# EAGLE design USB_Switch_Tester (EAGLE 9.6.2)
AUTHOR: ladyada
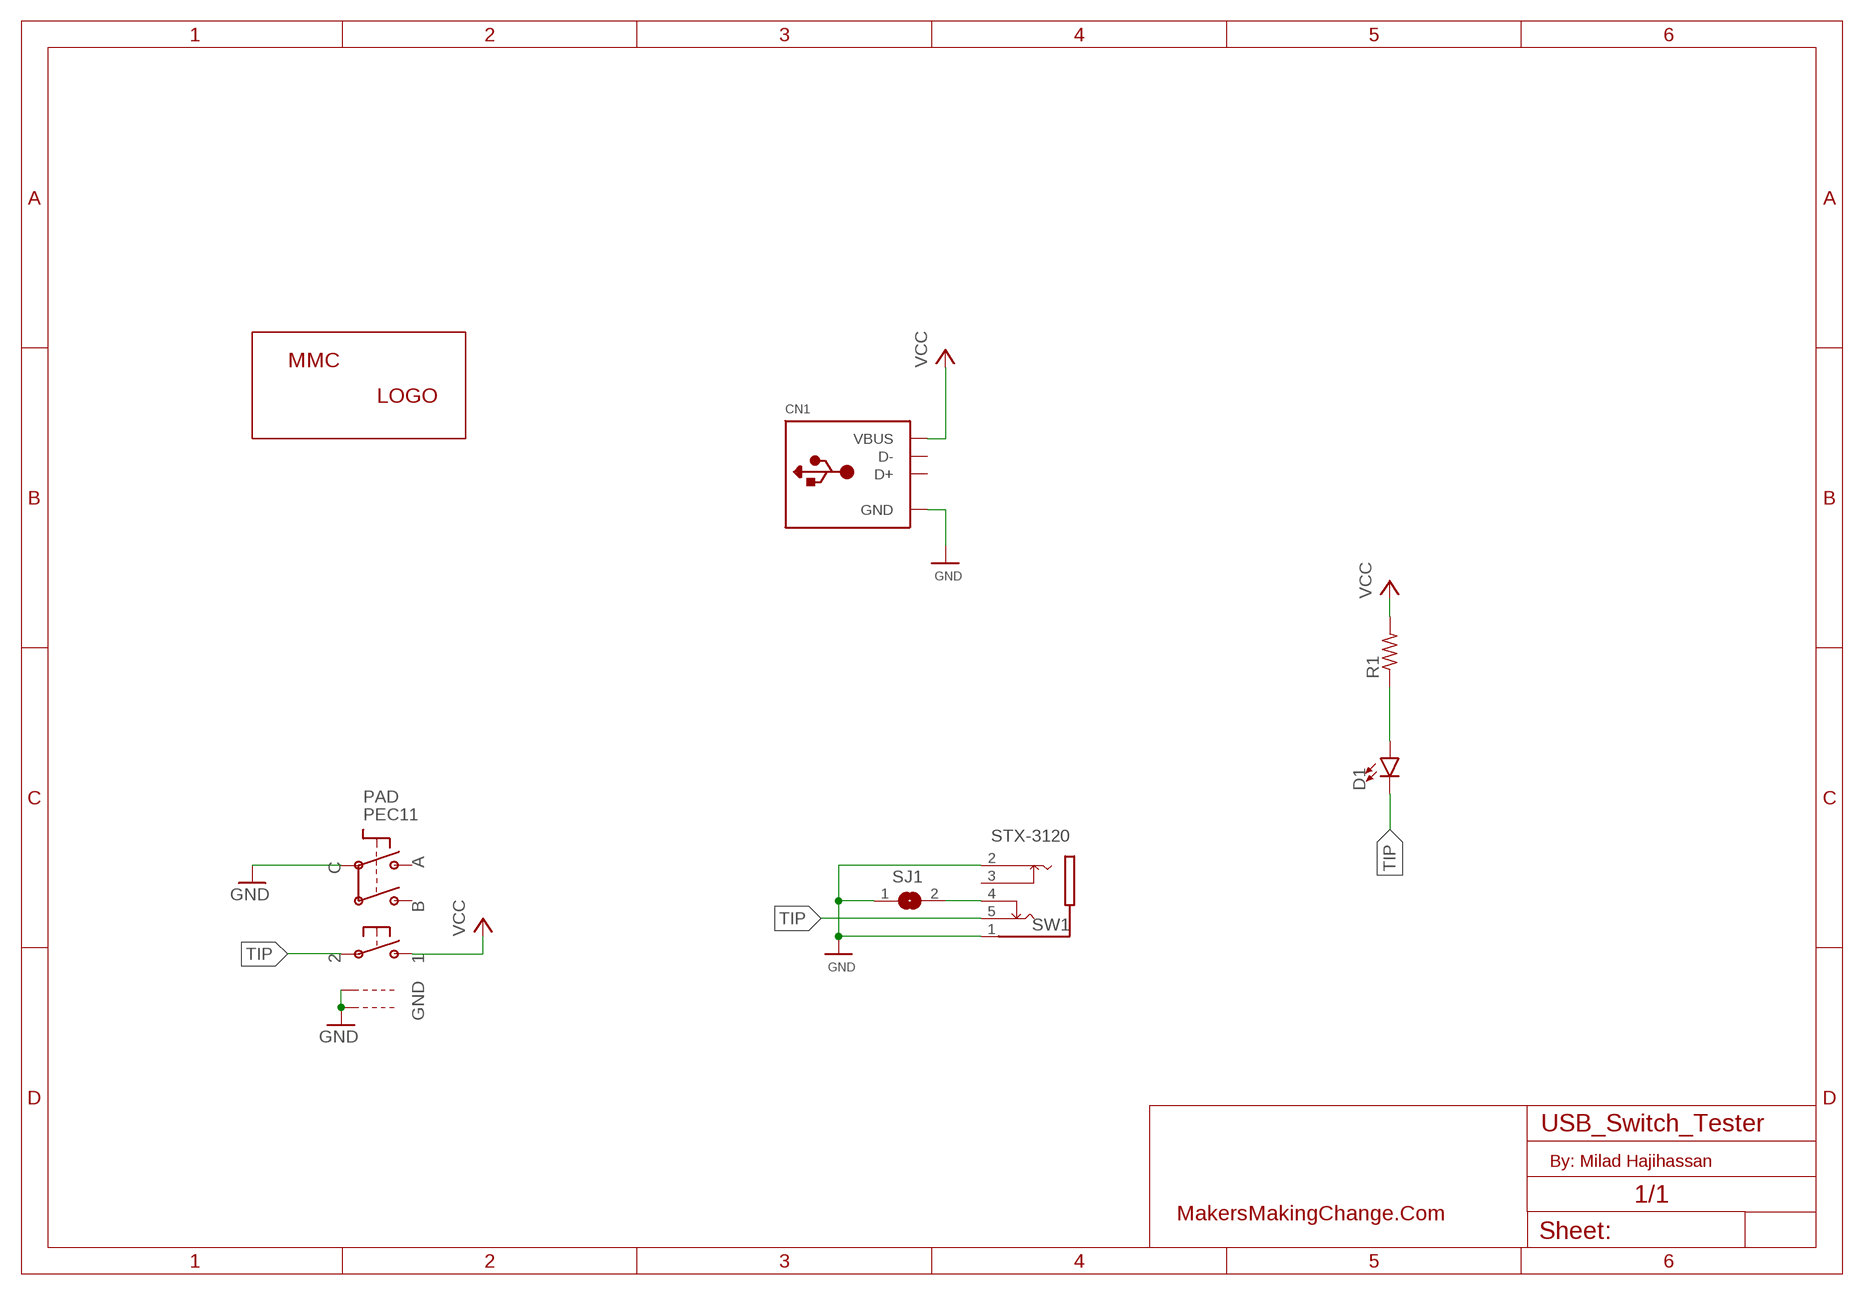
[diagram p0: schematic, sheet 1]

## Parts
CN1  MICROBUILDER_USB_TYPEAPCB  [MICROBUILDER_USBA_PCB]
D1  LED_5MM-5MM-RED  [LED_5MM_RED]
LABEL_LOGO  MMC_LOGO-XSM  [MMC_X-SMALL_LOGO]
PAD  PEC11  ADAFRUIT_ELECTROMECH_ENCODER_PLUS_SWITCH_BOURNS_PEC11  [ADAFRUIT_ELECTROMECH_PEC11+SWITCH]
R1  RESISTOR-US-0204/5  [RESISTOR_0204/5]
SJ1  SOLDERJUMPERREFLOW  [SOLDERJUMPER_REFLOW]
SW1  STX-3120  STX-3120-5B  [STX-3120-5B]

## Nets
GND: CN1.GND PAD.P$C PAD.P$GND1 PAD.P$GND2 SJ1.1 SW1.1 SW1.2
N$1: D1.A R1.1
N$2: SJ1.2 SW1.4
TIP: D1.K(C) PAD.P$2 SW1.5
VCC: CN1.VCC(VBUS) PAD.P$1 R1.2
Unconnected: CN1.USB_NEG(D-) CN1.USB_PLUS(D+) PAD.P$A PAD.P$B SW1.3

## Notes on the sheet
- By: Milad Hajihassan
- MakersMakingChange.Com

## Library data of the parts
CN1 = USB_Switch_Tester:MICROBUILDER_USB_TYPEA: USB - Type A Connectors Male types stick out and are inserted into a PC or matching females parts (these are the connectors used on USB Memory Sticks, etc.). Female parts are generally used for USB Host and accept a male-type connector. SMT - 4UCON: 10017 PTHFML - Digikey: 609-1045-ND, 4UCon: 05241 PCB - Use 2.0mm thick PCBs with this footprint
D1 = MMC Eagle:LED_5MM-: LED (Generic) Standard schematic elements and footprints for 5mm, 3mm, 1206, and 0603 sized LEDs. Generic LEDs with no color specified.
LABEL_LOGO = MMC Eagle:MMC_LOGO-
PAD = USB_Switch_Tester:ADAFRUIT_ELECTROMECH_ENCODER_PLUS_SWITCH: Rotary Encoder with Built-In Switch PEC11 - 24 Step, PEC11-4215F-S24 - http://www.adafruit.com/products/377
R1 = MMC Eagle:RESISTOR-US-: RESISTOR, American symbol
SJ1 = MMC_SMD:SOLDERJUMPER: SMD Solder JUMPER Solder the two pads together to create a connection, or remove the solder to break it. REFLOW - Use this footprint for solder paste and reflow ovens. WAVE - Use this footprint for hand-soldering (larger pads). CLOSED - Has a trace between the two pads to ensure it is closed by default. The trace needs to be cut to disable the jumper, and can be closed again by creating a solder bridge between the two pads.
SW1 = MMC Eagle:STX-3120-5B

## Board
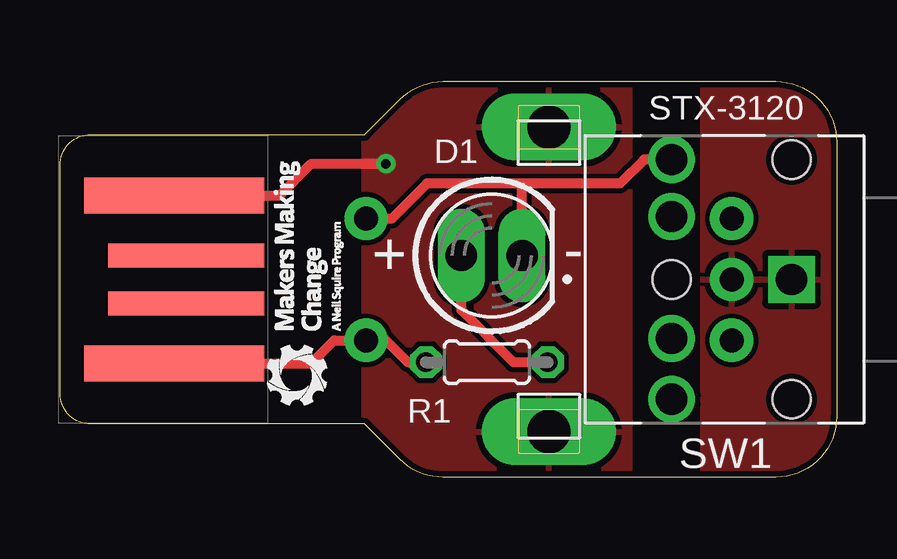
[diagram p1: board, top side]
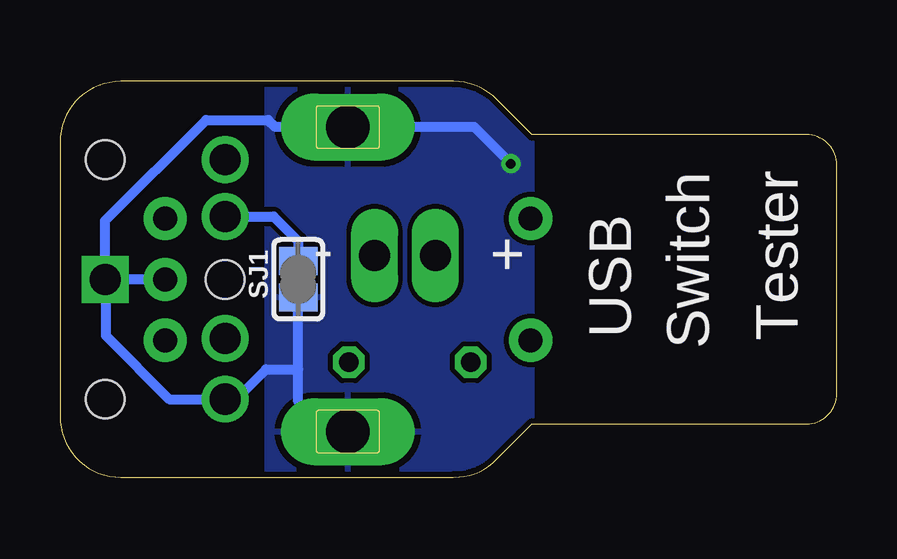
[diagram p2: board, bottom side, seen from below]

Size 32.38 x 16.51 mm. Coordinates in mm from the lower left corner, seen from the top.
Outline: 0,13.02 arc-90 1.27,14.29 12.7,14.29 14.18,15.77 arc-45 15.97,16.51 29.84,16.51 arc-90 32.38,13.97 32.38,2.54 arc-90 29.84,0 15.97,0 arc-45 14.18,0.74 12.7,2.22 1.27,2.22 arc-90 0,3.49 0,13.02
Copper layers (1*16): Top 0.035mm / dielectric 1.5mm / Bottom 0.035mm
Design rules "adafruit 8-8 *": minimum track width 8mil, minimum drill 15.5mil, track to track 8mil, track to pad 8mil, pad to pad 8mil, via to via 8mil, smd to smd 8mil, copper to edge 10mil, drill to drill 8mil, minimum pad ring 10mil, minimum via ring 8mil, stop-mask expansion 2mil, vias tented up to drill 20mil, thermal gap 10mil

### Footprints (pad centres in the part's own frame; a part is rotated, then mirrored left to right if it is on the bottom)
MICROBUILDER_USBA_PCB = smd 7.5 x 1.5: GND -0.2,3.5; VCC -0.2,-3.5 | smd 6.5 x 1: USB_NEG 0.3,-1; USB_PLUS 0.3,1
LED_5MM_RED = drill 1.3 pad 1.676 long: A -1.27,0; K 1.27,0
ADAFRUIT_ELECTROMECH_PEC11+SWITCH = drill 1 pad 1.8: P$1 -2.54,7.62; P$2 2.54,7.62; P$A -2.54,-7.62; P$B 2.54,-7.62; P$C 0,-7.62 | drill 1.8 pad 2.8 long: P$GND1 -6.35,0; P$GND2 6.35,0
RESISTOR_0204/5 = drill 0.813 octagon: 1 -2.54,0; 2 2.54,0
SOLDERJUMPER_REFLOW = smd 1.168 x 1.6: 1 -0.762,0; 2 0.762,0
STX-3120-5B = drill 1.3 square: 1 0,0 | drill 1.3: 2 5,5; 3 5,2.46; 4 5,-2.62; 5 5,-5 | hole 1.6: 0,5; 0,-5; 5,0

### Placement (x,y rotation side)
CN1  4.95,8.26 0 top
D1  18,9.25 0 top
LABEL_LOGO  11.8,8 90 top
PAD  20.38,8.26 90 top
R1  17.8,4.8 180 top
SJ1  22.45,8.26 90 bottom
SW1  30.5,8.26 180 top

### Tracks (layer width: path | path; a pad name or v marks a point on that pad's centre or on a via)
GND  (via drill 0.39)
  Top 0.406: CN1.GND 9.15,11.76 10.48,13.08 v13.59,13.08
  Bottom 0.406: v13.59,13.08 15.11,14.61 PAD.P$GND2 23.41,14.61 23.7,14.9 26.3,14.9 30.5,10.7 SW1.1 30.47,8.22 | 30.47,8.22 30.47,5.9 27.82,3.25 SW1.2 25.05,3.25 23.8,4.5 22.45,4.5 | PAD.P$C 30.44,8.26 30.47,8.22 | 22.45,4.5 SJ1.1 | PAD.P$GND1 21.2,1.91 22.45,3.15 22.45,4.5
  pour Top: 12.7,16.51 23.75,16.51 23.75,0 12.7,0
  pour Bottom: 12.7,16.51 23.75,16.51 23.75,0 12.7,0
  pour Top: 26.82,16.51 32.38,16.51 32.38,0 26.82,0
N$1
  Top 0.406: R1.1 18.9,4.8 16.73,6.97 D1.A
N$2
  Bottom 0.406: SW1.4 23.48,10.88 22.45,9.85 SJ1.2
TIP
  Top 0.406: PAD.P$2 13.85,10.79 15.3,12.25 19.4,12.25 | SW1.5 24.36,13.26 23.35,12.25 19.4,12.25 | D1.K 19.27,12.12 19.4,12.25
VCC
  Top 0.406: CN1.VCC 10.47,4.75 11.43,5.71 PAD.P$1 13.59,5.71 14.5,4.8 R1.2

### Text on the board
bPlace: Tester | Switch | USB
tValues: C1898